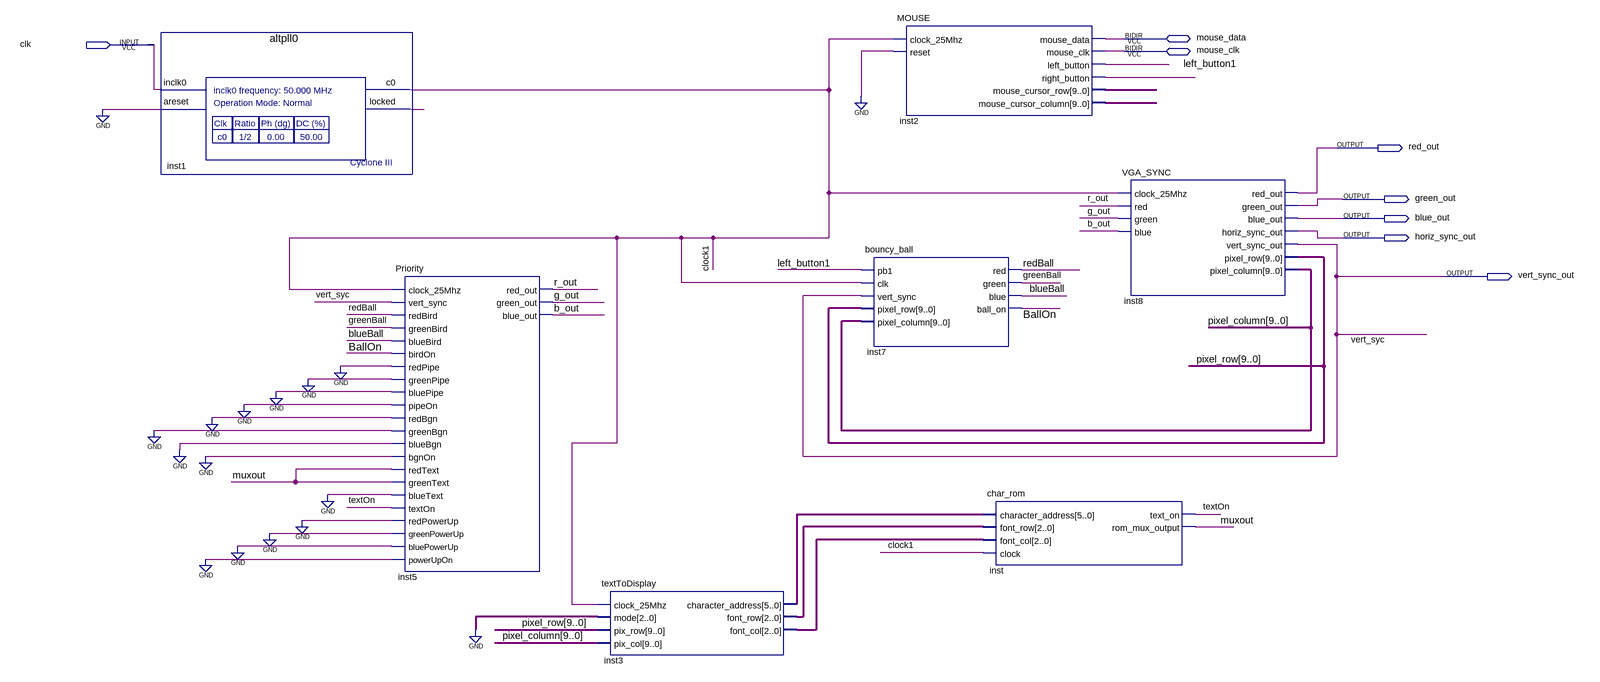
[diagram p0: schematic sheet]
// Quartus schematic ballWMouse.bdf as structural Verilog: 7 symbols, 8 pins
module ballWMouse (
  input  clk,
  inout  mouse_data,
  inout  mouse_clk,
  output red_out,
  output green_out,
  output blue_out,
  output horiz_sync_out,
  output vert_sync_out
);

  wire b_out, BallOn, blueBall, clock1, g_out, greenBall, inst1_locked, inst2_right_button, left_button1,
       muxout, r_out, redBall, textOn;
  wire [2:0] inst3_font_col, inst3_font_row;
  wire [5:0] inst3_character_address;
  wire [9:0] inst2_mouse_cursor_column, inst2_mouse_cursor_row, pixel_column, pixel_row;

  altpll0 inst1 (.inclk0(clk), .areset(1'b0), .c0(clock1), .locked(inst1_locked));
  Priority inst5 (
    .clock_25Mhz(clock1), .vert_sync(vert_sync_out), .redBird(redBall), .greenBird(greenBall),
    .blueBird(blueBall), .birdOn(BallOn), .redPipe(1'b0), .greenPipe(1'b0), .bluePipe(1'b0), .pipeOn(1'b0),
    .redBgn(1'b0), .greenBgn(1'b0), .blueBgn(1'b0), .bgnOn(1'b0), .redText(muxout), .greenText(muxout),
    .blueText(1'b0), .textOn(textOn), .redPowerUp(1'b0), .greenPowerUp(1'b0), .bluePowerUp(1'b0),
    .powerUpOn(1'b0), .red_out(r_out), .green_out(g_out), .blue_out(b_out));
  textToDisplay inst3 (
    .clock_25Mhz(clock1), .mode(3'b000), .pix_row(pixel_row), .pix_col(pixel_column),
    .character_address(inst3_character_address), .font_row(inst3_font_row), .font_col(inst3_font_col));
  bouncy_ball inst7 (
    .pb1(left_button1), .clk(clock1), .vert_sync(vert_sync_out), .pixel_row(pixel_row),
    .pixel_column(pixel_column), .red(redBall), .green(greenBall), .blue(blueBall), .ball_on(BallOn));
  MOUSE inst2 (
    .clock_25Mhz(clock1), .reset(1'b0), .left_button(left_button1), .right_button(inst2_right_button),
    .mouse_cursor_row(inst2_mouse_cursor_row), .mouse_cursor_column(inst2_mouse_cursor_column),
    .mouse_data(mouse_data), .mouse_clk(mouse_clk));
  char_rom inst (
    .character_address(inst3_character_address), .font_row(inst3_font_row), .font_col(inst3_font_col),
    .clock(clock1), .text_on(textOn), .rom_mux_output(muxout));
  VGA_SYNC inst8 (
    .clock_25Mhz(clock1), .red(r_out), .green(g_out), .blue(b_out), .red_out(red_out), .green_out(green_out),
    .blue_out(blue_out), .horiz_sync_out(horiz_sync_out), .vert_sync_out(vert_sync_out),
    .pixel_row(pixel_row), .pixel_column(pixel_column));

  // Other names for the same wires on the sheet: vert_syc = vert_sync_out
endmodule
